# Altium project Sensor_Leaf.PrjPCB
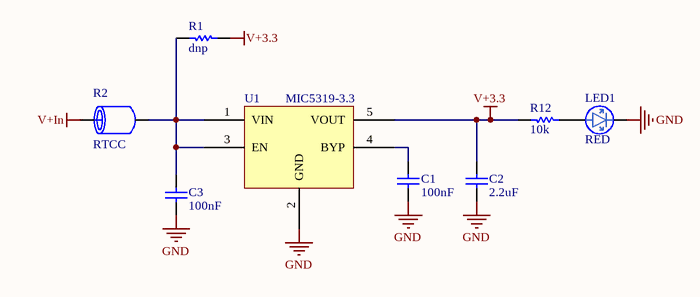
[diagram p0: PowerSupply.SchDoc]
4 sheets, 31 parts. Net scope: global (net labels, ports and power ports of the same name join across sheets).
Board file: PCB.PcbDoc
Sheets:
  PowerSupply.SchDoc
  MCU.SchDoc
  Sensor.SchDoc
  RS485.SchDoc

## Sheet PowerSupply.SchDoc
size A4

### Parts
C1  100nF  [0603]
C2  2.2uF  [0805]
C3  100nF  [0603]
LED1  RED  [LED-0603-RED]
R1  dnp  [0603]
R2  RTCC  [0805]
R12  10k  [0603]
U1  MIC5319-3.3  [sot23-5]

### Nets
GND: C1.1 C2.1 C3.1 LED1.K U1.2(GND)
V+3.3: C2.2 R1.1 R12.2 U1.5(VOUT)
V+In: R2.1
NetC1_2: C1.2 U1.4(BYP)
NetC3_2: C3.2 R1.2 R2.2 U1.1(VIN) U1.3(EN)
NetLED1_A: LED1.A R12.1

### Library data of the parts
C1 C3 = Cap Semi: Capacitor (Semiconductor SIM Model); Published: 8-Jun-2000; LatestRevisionDate: 29-May-2009; LatestRevisionNote: IPC-7351 Footprint Added.; PackageReference: C1206; Publisher: Altium Limited; PackageDescription: Chip Capacitor; Value: 100nF
C2 = Cap Semi: Capacitor (Semiconductor SIM Model); Value: 100nF; Published: 8-Jun-2000; LatestRevisionDate: 29-May-2009; LatestRevisionNote: IPC-7351 Footprint Added.; PackageReference: C1206; Publisher: Altium Limited; PackageDescription: Chip Capacitor
LED1 = SMD_LED_0805
R1 R12 = Res Semi: Semiconductor Resistor; Value: 1M; Published: 8-Jun-2000; LatestRevisionDate: 17-Jul-2002; LatestRevisionNote: Re-released for DXP Platform.; PackageReference: AXIAL-0.5; Publisher: Altium Limited
R2 = Ferritbeat: Manufacturer: MURATA; Manufacturer Part Number: BLM18EG471SN1D; Supplier 1: Farnell; Supplier Part Number 1: 1515722; RoHS: YES; Stock 1: 11384; Pricing 1: 5=0,196, 50=0,17, 100=0,14, 250=0,112, 500=0,101, 2000=0,092 (EUR); ComponentLink1URL: http://www.farnell.com/datasheets/5169.pdf; ComponentLink1Description: http://www.farnell.com/datasheets/5169.pdf
U1 = MIC5305

## Sheet MCU.SchDoc
size A4
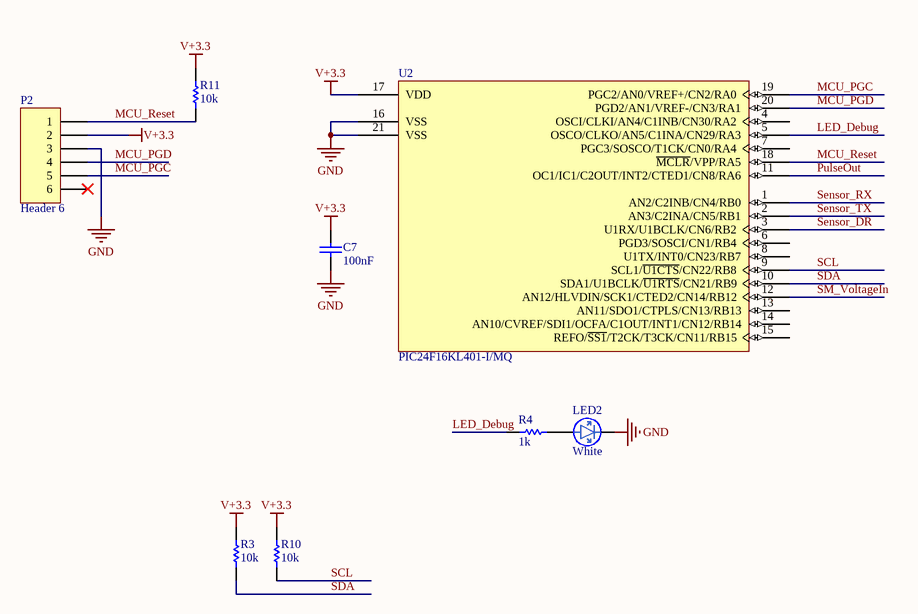
[diagram p1: MCU.SchDoc]

### Parts
C7  100nF  [0603]
LED2  White  [LED-0603-RED]
P2  Header 6  [MHDR1X6]
R3  10k  [0603]
R4  1k  [0603]
R10  10k  [0603]
R11  10k  [0603]
U2  PIC24F16KL401-I/MQ  [QFN-MQ20_N]

### Nets
GND: C7.2 LED2.K P2.3 U2.16(VSS) U2.21(VSS)
V+3.3: C7.1 P2.2 R3.2 R10.2 R11.2 U2.17(VDD)
LED_Debug: R4.1 U2.5(OSCO/CLKO/AN5/C1INA/CN29/RA3)
MCU_PGC: P2.5 U2.19(PGC2/AN0/VREF+/CN2/RA0)
MCU_PGD: P2.4 U2.20(PGD2/AN1/VREF-/CN3/RA1)
MCU_Reset: P2.1 R11.1 U2.18(~{MCLR}/VPP/RA5)
PulseOut: U2.11(OC1/IC1/C2OUT/INT2/CTED1/CN8/RA6)
SCL: R10.1 U2.9(SCL1/~{U1CTS}/CN22/RB8)
SDA: R3.1 U2.10(SDA1/U1BCLK/~{U1RTS}/CN21/RB9)
Sensor_DR: U2.3(U1RX/U1BCLK/CN6/RB2)
Sensor_RX: U2.1(AN2/C2INB/CN4/RB0)
Sensor_TX: U2.2(AN3/C2INA/CN5/RB1)
SM_VoltageIn: U2.12(AN12/HLVDIN/SCK1/CTED2/CN14/RB12)
NetLED2_A: LED2.A R4.2

Not connected (* = marked no-connect by the designer): P2 6*; U2 4(OSCI/CLKI/AN4/C1INB/CN30/RA2) 6(PGD3/SOSCI/CN1/RB4) 7(PGC3/SOSCO/T1CK/CN0/RA4) 8(U1TX/INT0/CN23/RB7) 13(AN11/SDO1/CTPLS/CN13/RB13) 14(AN10/CVREF/SDI1/OCFA/C1OUT/INT1/CN12/RB14) 15(REFO/~{SS1}/T2CK/T3CK/CN11/RB15)

### Library data of the parts
C7 = Cap Semi: Capacitor (Semiconductor SIM Model); Published: 8-Jun-2000; LatestRevisionDate: 29-May-2009; LatestRevisionNote: IPC-7351 Footprint Added.; PackageReference: C1206; Publisher: Altium Limited; PackageDescription: Chip Capacitor; Value: 100nF
LED2 = SMD_LED_0805
P2 = Header 6: Header, 6-Pin; LatestRevisionDate: 17-Jul-2002; LatestRevisionNote: Re-released for DXP Platform.; Publisher: Altium Limited
R3 R10 R11 = Res1: Resistor; Value: 1K; Published: 8-Jun-2000; LatestRevisionDate: 17-Jul-2002; LatestRevisionNote: Re-released for DXP Platform.; PackageReference: AXIAL-0.3; Publisher: Altium Limited
R4 = Res1: Resistor; Published: 8-Jun-2000; LatestRevisionDate: 17-Jul-2002; LatestRevisionNote: Re-released for DXP Platform.; PackageReference: AXIAL-0.3; Publisher: Altium Limited; Value: 1K
U2 = PIC24F04KA201T-I/MQ: General Purpose 16-Bit Flash Microcontroller with nanoWatt XLP Technology, 4KB Flash, 512 bytes SRAM, 20-Pin QFN, Industrial Temperature, Tape and Reel; FirstPublished: 2-Dec-2009; DatasheetVersion: revB, May-2009; PackageVersion: revBB, Aug-2009; PackageReference: QFN-MQ20; Publisher: Altium Limited; PackageDescription: 20-Lead Plastic Quad Flat, No Lead Package (MQ) - 5x5x0.9 mm Body [QFN]; Supplier 1: Digi-Key; Supplier Part Number 1: PIC24F04KA201T-I/MQ-ND; Supplier 2: Newark; Supplier Part Number 2: 08R2010; ComponentLink1Description: Datasheet; ComponentLink1URL: http://ww1.microchip.com/downloads/en/DeviceDoc/39937b.pdf; ComponentLink2Description: Packaging Specification; ComponentLink2URL: http://www.microchip.com/stellent/groups/techpub_sg/documents/packagingspec/en012702.pdf; ComponentLink3Description: Microchip.com Home; ComponentLink3URL: http://www.microchip.com/

## Sheet Sensor.SchDoc
size A4
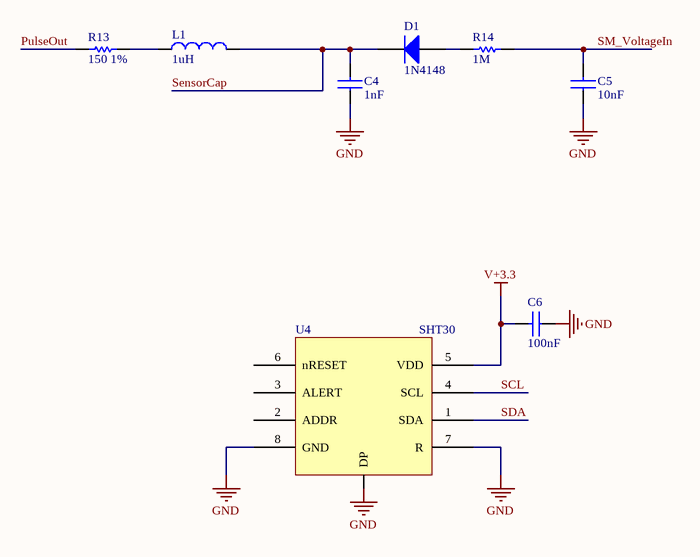
[diagram p2: Sensor.SchDoc]

### Parts
C4  1nF  [0603]
C5  10nF  [0603]
C6  100nF  [0603]
D1  1N4148  [D1810]
L1  1uH  [1210]
R13  150 1%  [0603]
R14  1M  [0603]
U4  SHT30  [QFN50P250X250X100_HS-9N]

### Nets
GND: C4.1 C5.1 C6.1 U4.0(DP) U4.7(R) U4.8(GND)
V+3.3: C6.2 U4.5(VDD)
PulseOut: R13.1
SCL: U4.4(SCL)
SDA: U4.1(SDA)
SensorCap: C4.2 D1.2(K) L1.2
SM_VoltageIn: C5.2 R14.1
NetD1_1: D1.1(A) R14.2
NetL1_1: L1.1 R13.2

Not connected (* = marked no-connect by the designer): U4 2(ADDR) 3(ALERT) 6(nRESET)

### Library data of the parts
C4-C6 = C_0402: Manufacturer: AVX; Manufacturer Part Number: 04023A101JAT2A; Supplier 1: Farnell; Supplier Part Number 1: 1327622; RoHS: YES; Stock 1: 84696; Pricing 1: 10=0,129, 100=0,099, 500=0,067, 1000=0,056, 5000=0,043 (EUR); ComponentLink1URL: http://www.avx.com/docs/Catalogs/ccog.pdf; ComponentLink1Description: http://www.avx.com/docs/Catalogs/ccog.pdf
D1 = Diode: Default Diode; Published: 8-Jun-2000; LatestRevisionDate: 17-Jul-2002; LatestRevisionNote: Re-released for DXP Platform.; PackageVersion: Sep-1996; PackageReference: SMC; Publisher: Altium Limited; PackageDescription: DO-214-AB/SMC; 2 C-Bend Leads; Body 7.9 x 5.9 mm, inc. leads (LxW); Code_JEDEC: DO-214-AB
L1 = Inductor: Code_IEC: 1005; Value: 1.5µH; Published: 8-Jun-2000; LatestRevisionDate: 29-May-2009; LatestRevisionNote: IPC-7351 Footprint Added.; PackageReference: 0402-A; Publisher: Altium Limited; PackageDescription: Chip Inductor; Code_JEITA: 0402
R13 = Res Semi: Semiconductor Resistor; Value: 1M; Published: 8-Jun-2000; LatestRevisionDate: 17-Jul-2002; LatestRevisionNote: Re-released for DXP Platform.; PackageReference: AXIAL-0.5; Publisher: Altium Limited
R14 = Res Semi: Semiconductor Resistor; Published: 8-Jun-2000; LatestRevisionDate: 17-Jul-2002; LatestRevisionNote: Re-released for DXP Platform.; PackageReference: AXIAL-0.5; Publisher: Altium Limited; Value: 1M
U4 = SHT3x

## Sheet RS485.SchDoc
size A4
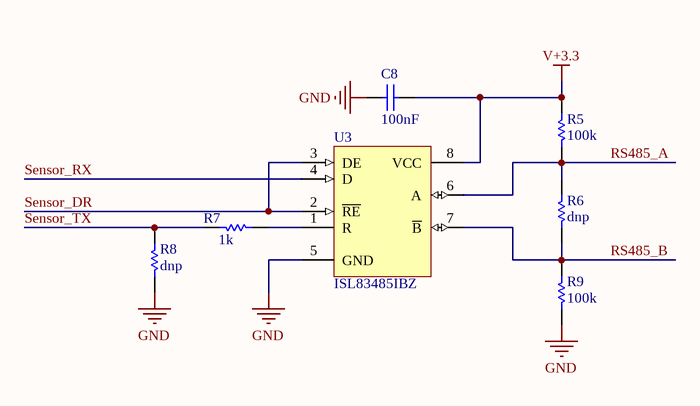
[diagram p3: RS485.SchDoc]

### Parts
C8  100nF  [0603]
R5  100k  [0603]
R6  dnp  [0603]
R7  1k  [0603]
R8  dnp  [0603]
R9  100k  [0603]
U3  ISL83485IBZ  [SO8]

### Nets
GND: C8.2 R8.1 R9.2 U3.5(GND)
V+3.3: C8.1 R5.1 U3.8(VCC)
RS485_A: R5.2 R6.1 U3.6(A)
RS485_B: R6.2 R9.1 U3.7(~{B})
Sensor_DR: U3.2(~{RE}) U3.3(DE)
Sensor_RX: U3.4(D)
Sensor_TX: R7.1 R8.2
NetR7_2: R7.2 U3.1(R)

### Library data of the parts
C8 = Cap Semi: Capacitor (Semiconductor SIM Model); Published: 8-Jun-2000; LatestRevisionDate: 29-May-2009; LatestRevisionNote: IPC-7351 Footprint Added.; PackageReference: C1206; Publisher: Altium Limited; PackageDescription: Chip Capacitor; Value: 100nF
R5 R6 R9 = Res Semi: Semiconductor Resistor; Value: 4K7; Published: 8-Jun-2000; LatestRevisionDate: 17-Jul-2002; LatestRevisionNote: Re-released for DXP Platform.; PackageReference: AXIAL-0.5; Publisher: Altium Limited
R7 R8 = Res Semi: Semiconductor Resistor; Value: 1M; Published: 8-Jun-2000; LatestRevisionDate: 17-Jul-2002; LatestRevisionNote: Re-released for DXP Platform.; PackageReference: AXIAL-0.5; Publisher: Altium Limited
U3 = SN75176AD: Differential Bus Transceiver; Note: Receiver Hysteresis of 50mV Typical; Published: 15-May-2002; LatestRevisionDate: 13-Apr-2006; LatestRevisionNote: IPC-7351 Footprint Added.; DatasheetVersion: Aug-1989; PackageVersion: Jan-1998; PackageReference: D008; Publisher: Altium Limited; PackageDescription: 8-Pin Small Outline Integrated Circuit 1.27 mm Pitch; Code_IPC: SOIC127P600-8; ComponentLink1Description: Manufacturer Link; ComponentLink1URL: http://www.ti.com/; ComponentLink2Description: Datasheet; ComponentLink2URL: http://www-s.ti.com/sc/ds/sn75176a.pdf

## Nets that join several sheets
GND: PowerSupply (5 pins), MCU (5 pins), Sensor (6 pins), RS485 (C8.2 R8.1 R9.2 U3.5)
V+3.3: PowerSupply (C2.2 R1.1 R12.2 U1.5), MCU (6 pins), Sensor (C6.2 U4.5), RS485 (C8.1 R5.1 U3.8)
PulseOut: MCU (U2.11), Sensor (R13.1)
SCL: MCU (R10.1 U2.9), Sensor (U4.4)
SDA: MCU (R3.1 U2.10), Sensor (U4.1)
Sensor_DR: MCU (U2.3), RS485 (U3.2 U3.3)
Sensor_RX: MCU (U2.1), RS485 (U3.4)
Sensor_TX: MCU (U2.2), RS485 (R7.1 R8.2)
SM_VoltageIn: MCU (U2.12), Sensor (C5.2 R14.1)